# EAGLE design ansible bb (EAGLE 9.2.2)
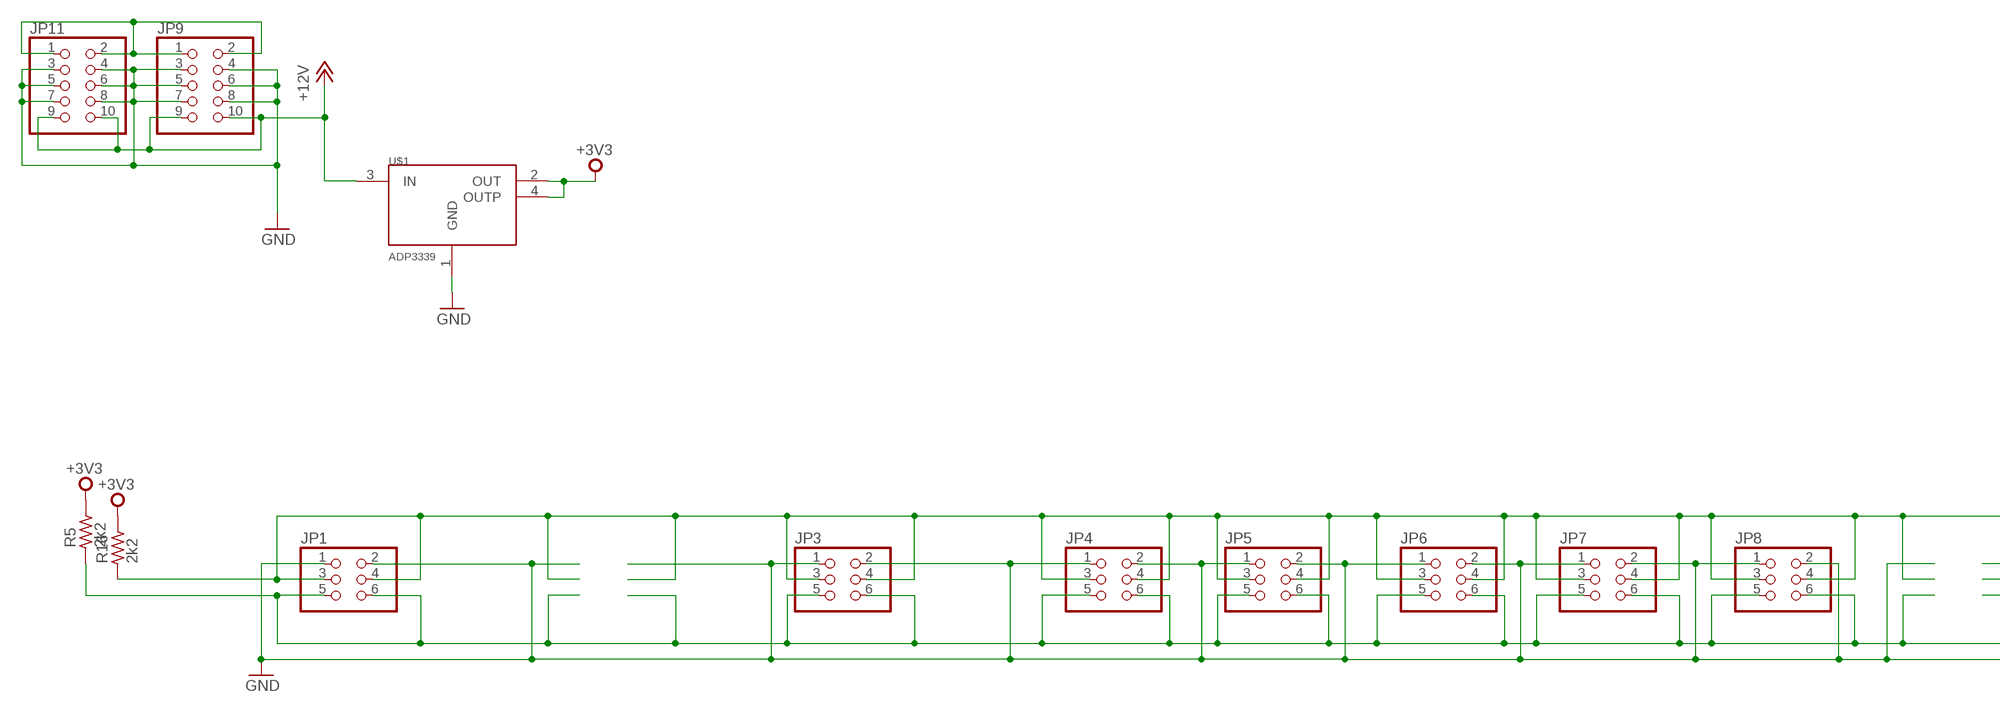
[diagram p0: schematic, sheet 1, part 1 of 2]
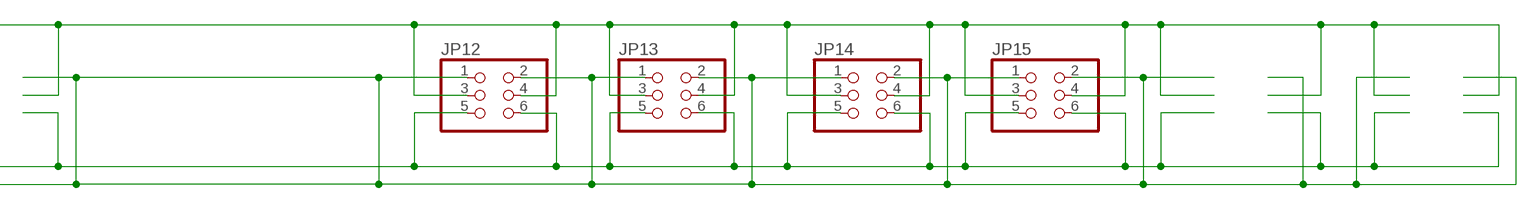
[diagram p1: schematic, sheet 1, part 2 of 2]

## Parts
JP1  PINHD-2X3  [2X03]
JP3  PINHD-2X3  [2X03]
JP4  PINHD-2X3  [2X03]
JP5  PINHD-2X3  [2X03]
JP6  PINHD-2X3  [2X03]
JP7  PINHD-2X3  [2X03]
JP8  PINHD-2X3  [2X03]
JP9  PINHD-2X5  [2X05]
JP11  PINHD-2X5  [2X05]
JP12  PINHD-2X3  [2X03]
JP13  PINHD-2X3  [2X03]
JP14  PINHD-2X3  [2X03]
JP15  PINHD-2X3  [2X03]
R5  2k2  R_1206  [R1206]
R16  2k2  R_1206  [R1206]
U$1  ADP3339  [SOT223]

## Nets
+3V3: R5.2 R16.2 U$1.2(OUT) U$1.4(OUTP)
+12V: JP9.9 JP9.10 JP11.9 JP11.10 U$1.3(IN)
GND: JP1.1 JP1.2 JP3.1 JP3.2 JP4.1 JP4.2 JP5.1 JP5.2 JP6.1 JP6.2 JP7.1 JP7.2 JP8.1 JP8.2 JP9.3 JP9.4 JP9.5 JP9.6 JP9.7 JP9.8 JP11.3 JP11.4 JP11.5 JP11.6 JP11.7 JP11.8 JP12.1 JP12.2 JP13.1 JP13.2 JP14.1 JP14.2 JP15.1 JP15.2 U$1.1(GND)
N$4: JP1.3 JP1.4 JP3.3 JP3.4 JP4.3 JP4.4 JP5.3 JP5.4 JP6.3 JP6.4 JP7.3 JP7.4 JP8.3 JP8.4 JP12.3 JP12.4 JP13.3 JP13.4 JP14.3 JP14.4 JP15.3 JP15.4 R16.1
N$5: JP1.5 JP1.6 JP3.5 JP3.6 JP4.5 JP4.6 JP5.5 JP5.6 JP6.5 JP6.6 JP7.5 JP7.6 JP8.5 JP8.6 JP12.5 JP12.6 JP13.5 JP13.6 JP14.5 JP14.6 JP15.5 JP15.6 R5.1
N$6: JP9.1 JP9.2 JP11.1 JP11.2

## Library data of the parts
JP1 JP3-JP8 JP12-JP15 = pinhead:PINHD-2X3: PIN HEADER
JP9 JP11 = pinhead:PINHD-2X5: PIN HEADER
R5 R16 = rc-master-smd:R_: RESISTOR
U$1 = monome-inc:ADP3339

## Board
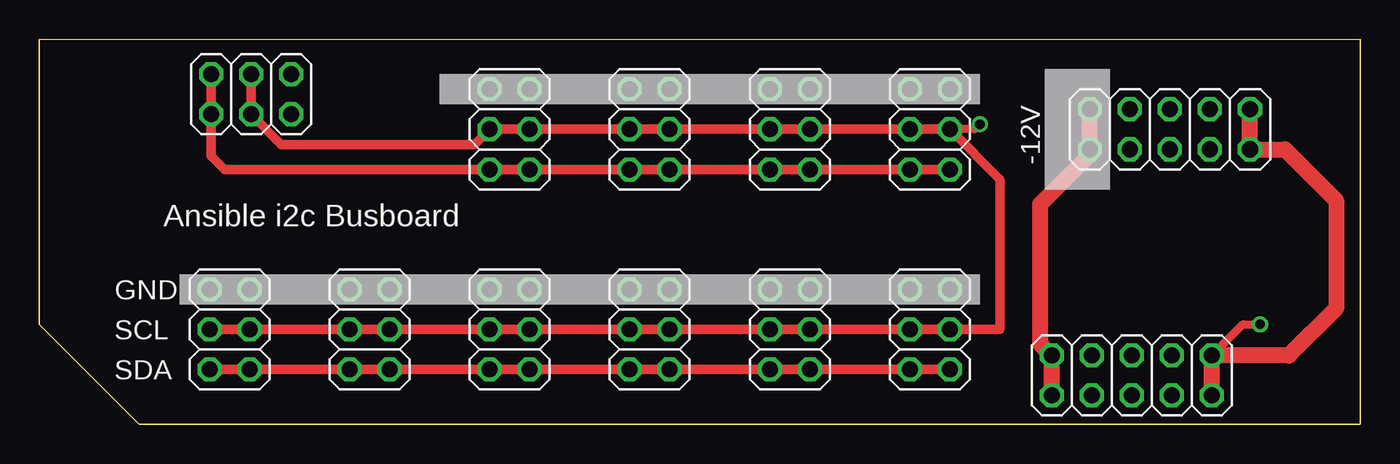
[diagram p2: board, top side]
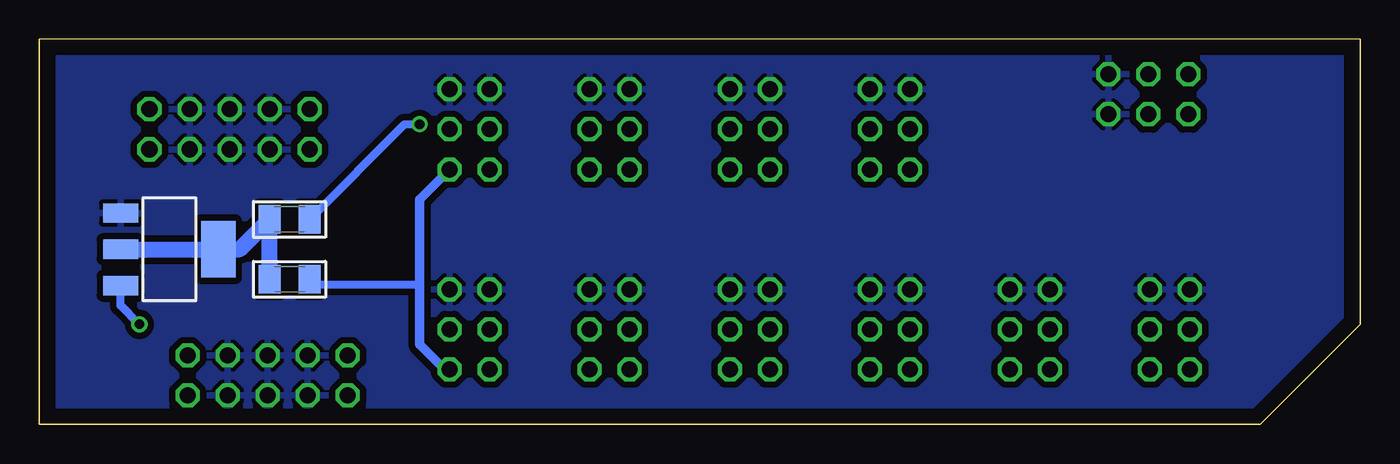
[diagram p3: board, bottom side, seen from below]

Size 83.82 x 24.45 mm. Coordinates in mm from the lower left corner, seen from the top.
Outline: 0,24.45 83.82,24.45 83.82,0 6.35,0 0,6.35 0,24.45
Copper layers (1*16): Top 0.035mm / dielectric 1.5mm / Bottom 0.035mm
Design rules "default": minimum track width 10mil, minimum drill 24mil, track to track 8mil, track to pad 8mil, pad to pad 8mil, via to via 8mil, smd to smd 8mil, copper to edge 40mil, drill to drill 8mil, minimum pad ring 10mil, minimum via ring 8mil, stop-mask expansion 4mil, vias tented up to drill 0mil, thermal gap 10mil
Milling: 5 lines

### Footprints (pad centres in the part's own frame; a part is rotated, then mirrored left to right if it is on the bottom)
2X03 = drill 1.016 octagon: 1 -2.54,-1.27; 2 -2.54,1.27; 3 0,-1.27; 4 0,1.27; 5 2.54,-1.27; 6 2.54,1.27
2X05 = drill 1.016 octagon: 1 -5.08,-1.27; 2 -5.08,1.27; 3 -2.54,-1.27; 4 -2.54,1.27; 5 0,-1.27; 6 0,1.27; 7 2.54,-1.27; 8 2.54,1.27; 9 5.08,-1.27; 10 5.08,1.27
R1206 = smd 1.4 x 1.8: 1 -1.27,0; 2 1.27,0
SOT223 = smd 1.219 x 2.235: 1 -2.311,-3.099; 2 0,-3.099; 3 2.311,-3.099 | smd 3.6 x 2.2: 4 0,3.099

### Placement (x,y rotation side)
JP1  13.45,20.95 180 top
JP3  29.84,18.73 270 top
JP4  38.73,18.73 270 top
JP5  12.06,6.03 270 top
JP6  20.95,6.03 270 top
JP7  29.84,6.03 270 top
JP8  38.73,6.03 270 top
JP9  69.33,3.1 0 top
JP11  71.75,18.73 0 top
JP12  47.62,18.73 270 top
JP13  47.62,6.03 270 top
JP14  56.52,18.73 270 top
JP15  56.52,6.03 270 top
R5  67.94,9.21 180 bottom
R16  67.94,13.02 180 bottom
U$1  75.56,11.11 270 bottom

### Tracks (layer width: path | path; a pad name or v marks a point on that pad's centre or on a via)
+3V3
  Bottom 1.016: U$1.2 U$1.4 71.12,11.11 R16.2 R5.2
+12V  (via drill 0.61)
  Top 0.508: JP9.10 76.39,6.35 v77.47,6.35
  Top 1.016: JP9.9 JP9.10 79.3,4.37 82.3,7.37 82.3,14.22 79.06,17.46 JP11.9 JP11.10
  Bottom 0.508: v77.47,6.35 78.66,7.54 U$1.3
GND
  pour Bottom (isolate 0.406): 0,0 0,24.45 83.82,24.45 83.82,0
N$4  (via drill 0.61)
  Top 0.508: v59.69,19.05 59.37,18.73 JP14.4
  Top 0.61: JP3.4 JP3.3 | JP3.3 JP4.4 JP4.3 JP12.4 JP12.3 JP14.4 | JP5.4 JP5.3 JP6.4 JP6.3 JP7.4 JP7.3 JP8.4 JP8.3 JP13.4 JP13.3 JP15.4 | JP15.4 JP15.3 | JP14.4 JP14.3 | JP14.4 60.96,15.56 60.96,6.03 JP15.4 | JP1.3 JP1.4 15.35,17.78 27.62,17.78 JP3.3
  Bottom 0.508: R16.1 60.64,19.05 v59.69,19.05
N$5
  Top 0.61: JP5.6 JP5.5 JP6.6 JP6.5 JP7.6 JP7.5 JP8.6 JP8.5 JP13.6 JP13.5 JP15.6 JP15.5 | JP3.5 JP4.6 JP4.5 JP12.6 JP12.5 JP14.6 JP14.5 | JP3.5 JP3.6 | JP3.5 11.75,16.19 10.91,17.03 JP1.6 JP1.5
  Bottom 0.508: R5.1 66.36,8.89 59.69,8.89
  Bottom 0.61: JP15.6 58.1,3.49 59.69,5.08 59.69,8.89 59.69,14.29 JP14.6
N$6
  Top 1.016: JP9.1 JP9.2 63.5,5.12 63.5,13.97 66.67,17.14 JP11.1 JP11.2

### Text on the board
tPlace: -12V | Ansible i2c Busboard | GND | SCL | SDA